# EAGLE design xmas_v3 (EAGLE 7.6.0)
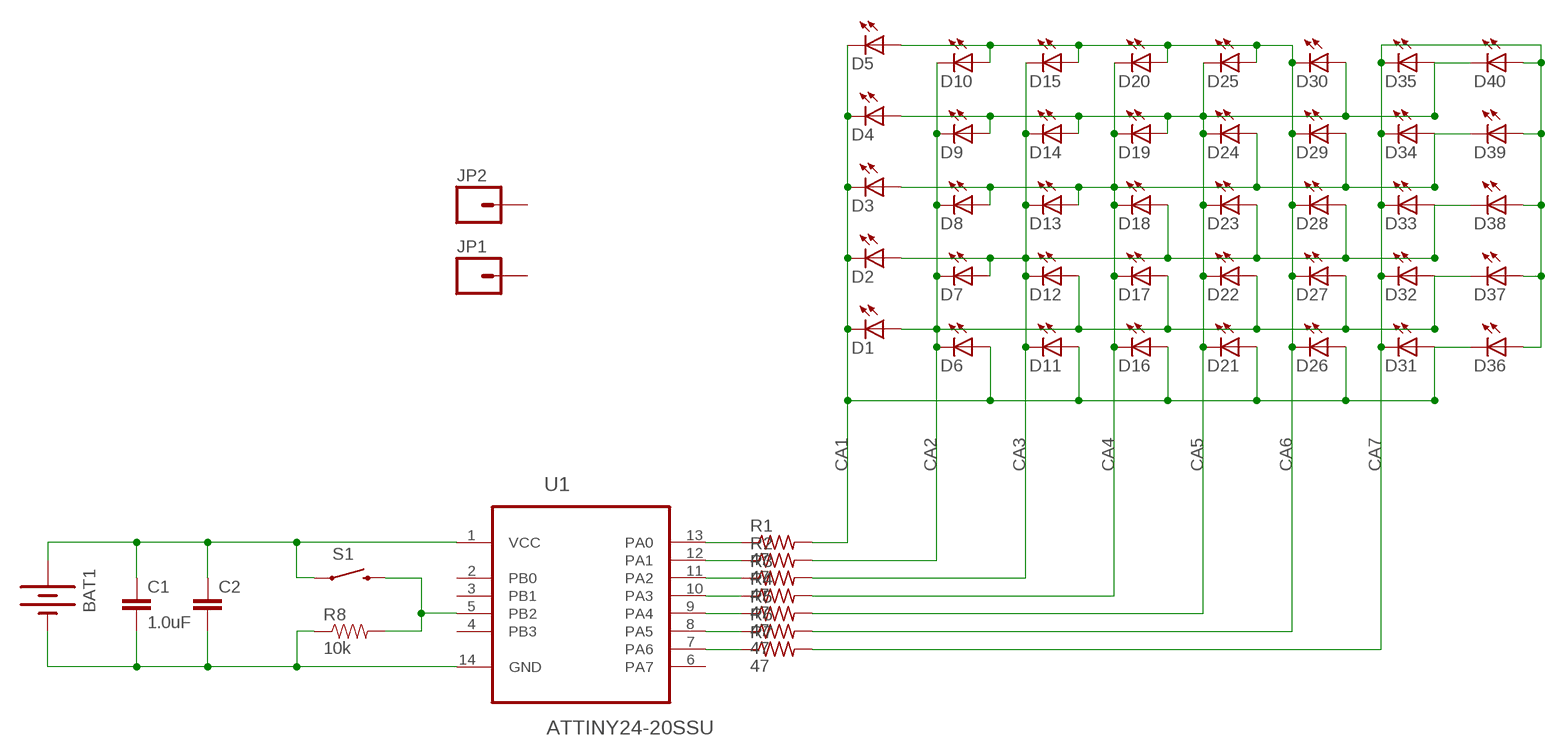
[diagram p0: schematic, sheet 1]

## Parts
BAT1  BATTERY20PTH  [BATTCOM_20MM_PTH]
C1  1.0uF  1.0UF-25V-+80/-20(0805)"  [0805-CAP]
C2  CAP0805  [0805]
D1  LEDCHIP-LED0603  [CHIP-LED0603]
D2  LEDCHIP-LED0603  [CHIP-LED0603]
D3  LEDCHIP-LED0603  [CHIP-LED0603]
D4  LEDCHIP-LED0603  [CHIP-LED0603]
D5  LEDCHIP-LED0603  [CHIP-LED0603]
D6  LEDCHIP-LED0603  [CHIP-LED0603]
D7  LEDCHIP-LED0603  [CHIP-LED0603]
D8  LEDCHIP-LED0603  [CHIP-LED0603]
D9  LEDCHIP-LED0603  [CHIP-LED0603]
D10  LEDCHIP-LED0603  [CHIP-LED0603]
D11  LEDCHIP-LED0603  [CHIP-LED0603]
D12  LEDCHIP-LED0603  [CHIP-LED0603]
D13  LEDCHIP-LED0603  [CHIP-LED0603]
D14  LEDCHIP-LED0603  [CHIP-LED0603]
D15  LEDCHIP-LED0603  [CHIP-LED0603]
D16  LEDCHIP-LED0603  [CHIP-LED0603]
D17  LEDCHIP-LED0603  [CHIP-LED0603]
D18  LEDCHIP-LED0603  [CHIP-LED0603]
D19  LEDCHIP-LED0603  [CHIP-LED0603]
D20  LEDCHIP-LED0603  [CHIP-LED0603]
D21  LEDCHIP-LED0603  [CHIP-LED0603]
D22  LEDCHIP-LED0603  [CHIP-LED0603]
D23  LEDCHIP-LED0603  [CHIP-LED0603]
D24  LEDCHIP-LED0603  [CHIP-LED0603]
D25  LEDCHIP-LED0603  [CHIP-LED0603]
D26  LEDCHIP-LED0603  [CHIP-LED0603]
D27  LEDCHIP-LED0603  [CHIP-LED0603]
D28  LEDCHIP-LED0603  [CHIP-LED0603]
D29  LEDCHIP-LED0603  [CHIP-LED0603]
D30  LEDCHIP-LED0603  [CHIP-LED0603]
D31  LEDCHIP-LED0603  [CHIP-LED0603]
D32  LEDCHIP-LED0603  [CHIP-LED0603]
D33  LEDCHIP-LED0603  [CHIP-LED0603]
D34  LEDCHIP-LED0603  [CHIP-LED0603]
D35  LEDCHIP-LED0603  [CHIP-LED0603]
D36  LEDCHIP-LED0603  [CHIP-LED0603]
D37  LEDCHIP-LED0603  [CHIP-LED0603]
D38  LEDCHIP-LED0603  [CHIP-LED0603]
D39  LEDCHIP-LED0603  [CHIP-LED0603]
D40  LEDCHIP-LED0603  [CHIP-LED0603]
JP1  M01PTH_NO_SILK_YES_STOP  [1X01_NO_SILK]
JP2  M01PTH_NO_SILK_YES_STOP  [1X01_NO_SILK]
R1  47  R-US_R0603  [R0603]
R2  47  R-US_R0603  [R0603]
R3  47  R-US_R0603  [R0603]
R4  47  R-US_R0603  [R0603]
R5  47  R-US_R0603  [R0603]
R6  47  R-US_R0603  [R0603]
R7  47  R-US_R0603  [R0603]
R8  10k  RESISTOR0805-RES  [0805]
S1  SWITCH-MOMENTARY-2SMD-4  [TACTILE_SWITCH_TALL]
U1  ATTINY24-20SSU  [SOIC127P600X175-14N]

## Nets
CA1: D1.C D2.C D3.C D4.C D5.C D6.A D11.A D16.A D21.A D26.A D31.A D36.C R1.2
CA2: D1.A D6.C D7.C D8.C D9.C D10.C D12.A D17.A D22.A D27.A D32.A D37.C R2.2
CA3: D2.A D7.A D11.C D12.C D13.C D14.C D15.C D18.A D23.A D28.A D33.A D38.C R3.2
CA4: D3.A D8.A D13.A D16.C D17.C D18.C D19.C D20.C D24.A D29.A D34.A D39.C R4.2
CA5: D4.A D9.A D14.A D19.A D21.C D22.C D23.C D24.C D25.C D30.A D35.A D40.C R5.2
CA6: D5.A D10.A D15.A D20.A D25.A D26.C D27.C D28.C D29.C D30.C R6.2
CA7: D31.C D32.C D33.C D34.C D35.C D36.A D37.A D38.A D39.A D40.A R7.2
GND: BAT1.2(-) C1.2 C2.2 R8.1 U1.14(GND)
N$1: BAT1.1(+) C1.1 C2.1 S1.A2 U1.1(VCC)
N$2: R8.2 S1.B2 U1.5(PB2)
N$3: R1.1 U1.13(PA0)
N$4: R2.1 U1.12(PA1)
N$5: R3.1 U1.11(PA2)
N$6: R4.1 U1.10(PA3)
N$7: R5.1 U1.9(PA4)
N$8: R6.1 U1.8(PA5)
N$9: R7.1 U1.7(PA6)
Unconnected: JP1.1 JP2.1 U1.2(PB0) U1.3(PB1) U1.4(PB3) U1.6(PA7)

## Library data of the parts
BAT1 = SparkFun-Electromechanical:BATTERY: Battery Holders Various common sizes : AA, AAA, 18650 (PRT-12895), 20mm coin cell and 12mm coin cell. 20MM_4LEGS, BATT-10373
C1 = SparkFun-Capacitors:1.0UF-25V-+80/-20(0805): CAP-11625; PROD_ID: CAP-11625
C2 = SparkFun-Capacitors:CAP: Capacitor Standard 0603 ceramic capacitor, and 0.1" leaded capacitor.
D1-D40 = adafruit:LED: LED OSRAM: - CHIPLED LG R971, LG N971, LY N971, LG Q971, LY Q971, LO R971, LY R971 LH N974, LH R974 LS Q976, LO Q976, LY Q976 LO Q996 - Hyper CHIPLED LW Q18S LB Q993, LB Q99A, LB R99A - SideLED LS A670, LO A670, LY A670, LG A670, LP A670 LB A673, LV A673, LT A673, LW A673 LH A674 LY A675 LS A676, LA A676, LO A676, LY A676, LW A676 LS A679, LY A679, LG A679 - Hyper Micro SIDELED® LS Y876, LA Y876, LO Y876, LY Y876 LT Y87S - SmartLED LW L88C, LW L88S LB L89C, LB L89S, LG L890 LS L89K, LO L89K, LY L89K LS L896, LA L896, LO L896, LY L896 - TOPLED LS T670, LO T670, LY T670, LG T670, LP T670 LSG T670, LSP T670, LSY T670, LOP T670, LYG T670 LG T671, LOG T671, LSG T671 LB T673, LV T673, LT T673, LW T673 LH T674 LS T676, LA T676, LO T676, LY T676, LB T676, LH T676, LSB T676, LW T676 LB T67C, LV T67C, LT T67C, LS T67K, LO T67K, LY T67K, LW E67C LS E67B, LA E67B, LO E67B, LY E67B, LB E67C, LV E67C, LT E67C LW T67C LS T679, LY T679, LG T679 LS T770, LO T770, LY T770, LG T770, LP T770 LB T773, LV T773, LT T773, LW T773 LH T774 LS E675, LA E675, LY E675, LS T675 LS T776, LA T776, LO T776, LY T776, LB T776 LHGB T686 LT T68C, LB T68C - Hyper Mini TOPLED® LB M676 - Mini TOPLED Santana® LG M470 LS M47K, LO M47K, LY M47K Source: http://www.osram.convergy.de/
JP1 JP2 = SparkFun-Connectors:M01: Header 1 Standard 1-pin 0.1" header. Use with straight break away headers (SKU : PRT-00116), right angle break away headers (PRT-00553), swiss pins (PRT-00743), machine pins (PRT-00117), and female headers (PRT-00115). SMTSO-256-ET is a "flush mount" nut for a 4-40 screw. The older package used to be too tight, and did not allow it to sit properly thru the drill hit. The latest (0.165DIA) fits nice and snug.
R1-R7 = resistor:R-US_: RESISTOR, American symbol
R8 = SparkFun-Passives:RESISTOR: Resistor Basic schematic elements and footprints for 0603, 1206, and PTH resistors.
S1 = SparkFun-Electromechanical:SWITCH-MOMENTARY-2: Various NO switches- pushbuttons, reed, etc; PROD_ID: SWCH-11966
U1 = Atmel_By_element14_Batch_1-00:ATTINY24-20SSU: 8-bit Microcontroller with Bytes In-System Programmable Flash; MPN: ATTINY24-20SSU; OC_FARNELL: 1455137; OC_NEWARK: 58M3775; PACKAGE: SOIC-14; SUPPLIER: Atmel

## Board
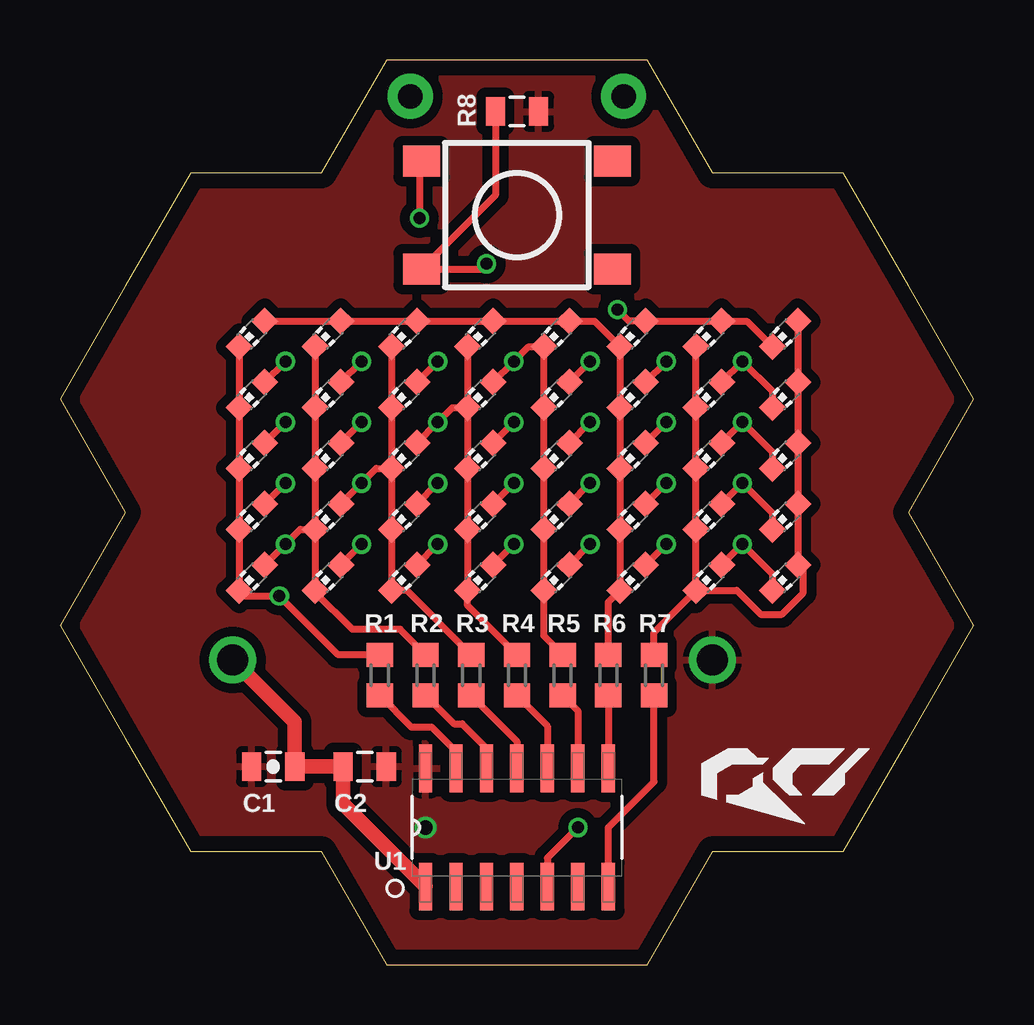
[diagram p1: board, top side]
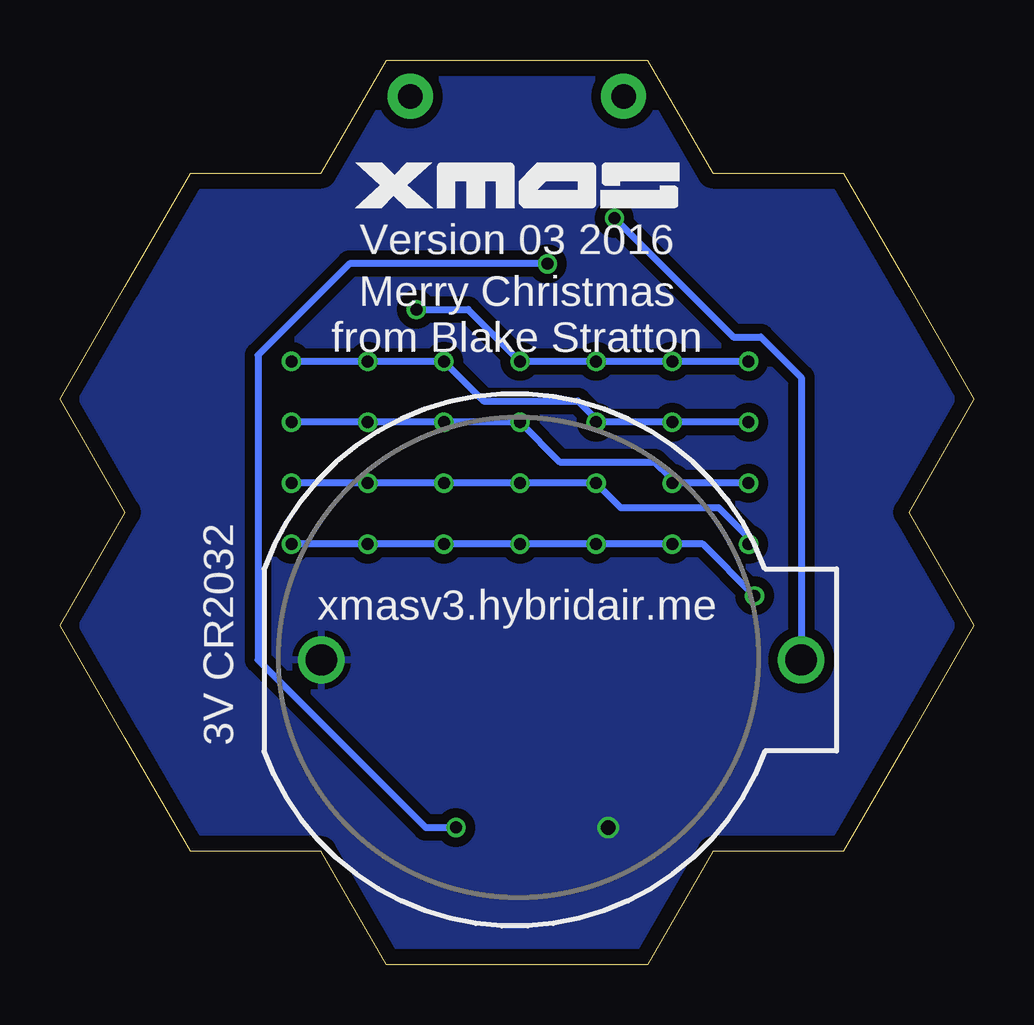
[diagram p2: board, bottom side, seen from below]

Size 38.1 x 37.71 mm. Coordinates in mm from the lower left corner, seen from the top.
Outline: 27.21,4.71 32.66,4.71 35.38,9.43 38.1,14.14 35.38,18.86 38.1,23.57 35.38,28.28 32.66,33 27.21,33 24.49,37.71 13.61,37.71 10.89,33 5.44,33 2.72,28.28 0,23.57 2.72,18.86 0,14.14 2.72,9.43 5.44,4.71 10.89,4.71 13.61,0 24.49,0 27.21,4.71
Copper layers (1*16): Top 0.035mm / dielectric 1.5mm / Bottom 0.035mm
Design rules "SeeedStudio_2layer_DRU_no_angle_20140221": minimum track width 6mil, minimum drill 12mil, track to track 6mil, track to pad 6mil, pad to pad 6mil, via to via 6mil, smd to smd 0mil, copper to edge 10mil, drill to drill 10mil, minimum pad ring 10mil, minimum via ring 6mil, stop-mask expansion 2mil, vias tented up to drill 100mil, thermal gap 10mil
tRestrict: 22 lines
bRestrict: 22 lines

### Footprints (pad centres in the part's own frame; a part is rotated, then mirrored left to right if it is on the bottom)
BATTCOM_20MM_PTH = drill 1.3: 1 11.85,0; 2 -8.15,0
0805-CAP = smd 0.8 x 1.2: 1 -0.9,0; 2 0.9,0
0805 = smd 0.8 x 1.2: 1 -0.9,0; 2 0.9,0
CHIP-LED0603 = smd 0.8 x 0.8: A 0,-0.75; C 0,0.75
1X01_NO_SILK = drill 1.016 pad 1.88: 1 0,0
R0603 = smd 1 x 1.1: 1 -0.85,0; 2 0.85,0
TACTILE_SWITCH_TALL = smd 1.55 x 1.3: A1 -3.975,-2.25; A2 3.975,-2.25; B1 -3.975,2.25; B2 3.975,2.25
SOIC127P600X175-14N = smd 1.981 x 0.559: 1 -2.464,3.81; 2 -2.464,2.54; 3 -2.464,1.27; 4 -2.464,0; 5 -2.464,-1.27; 6 -2.464,-2.54; 7 -2.464,-3.81; 8 2.464,-3.81; 9 2.464,-2.54; 10 2.464,-1.27; 11 2.464,0; 12 2.464,1.27; 13 2.464,2.54; 14 2.464,3.81

### Placement (x,y rotation side)
BAT1  19.05,12.7 0 bottom
C1  8.89,8.26 180 top
C2  12.7,8.26 0 top
D1  8,16.13 135 top
D2  8,18.67 135 top
D3  8,21.21 135 top
D4  8,23.75 135 top
D5  8,26.29 135 top
D6  11.18,16.13 135 top
D7  11.18,18.67 135 top
D8  11.18,21.21 135 top
D9  11.18,23.75 135 top
D10  11.18,26.29 135 top
D11  14.35,16.13 135 top
D12  14.35,18.67 135 top
D13  14.35,21.21 135 top
D14  14.35,23.75 135 top
D15  14.35,26.29 135 top
D16  17.53,16.13 135 top
D17  17.53,18.67 135 top
D18  17.53,21.21 135 top
D19  17.53,23.75 135 top
D20  17.53,26.29 135 top
D21  20.7,16.13 135 top
D22  20.7,18.67 135 top
D23  20.7,21.21 135 top
D24  20.7,23.75 135 top
D25  20.7,26.29 135 top
D26  23.88,16.13 135 top
D27  23.88,18.67 135 top
D28  23.88,21.21 135 top
D29  23.88,23.75 135 top
D30  23.88,26.29 135 top
D31  27.05,16.13 135 top
D32  27.05,18.67 135 top
D33  27.05,21.21 135 top
D34  27.05,23.75 135 top
D35  27.05,26.29 135 top
D36  30.23,16.13 135 top
D37  30.23,18.67 135 top
D38  30.23,21.21 135 top
D39  30.23,23.75 135 top
D40  30.23,26.29 135 top
JP1  14.61,36.2 0 top
JP2  23.5,36.2 0 top
R1  13.34,12.06 90 top
R2  15.24,12.06 90 top
R3  17.14,12.06 90 top
R4  19.05,12.06 90 top
R5  20.95,12.06 90 top
R6  22.86,12.06 90 top
R7  24.77,12.06 90 top
R8  19.05,35.56 180 top
S1  19.05,31.24 180 top
U1  19.05,5.71 90 top
U$1  [AR1]  26.67,5.84 0 top
U$2  [XMAS]  25.83,31.37 0 bottom

### Tracks (layer width: path | path; a pad name or v marks a point on that pad's centre or on a via)
CA1  (via drill 0.5)
  Top 0.3: D5.C D4.C D3.C D2.C D1.C 7.7,15.37 v9.14,15.37 11.6,12.91 R1.2 | D6.A v12.57,17.53 | D11.A v15.75,17.53 | D16.A v18.92,17.53 | D21.A v22.1,17.53 | D26.A v25.27,17.53 | D31.A v28.45,17.53 29.7,16.28 D36.C
  Bottom 0.3: v9.14,15.37 11.3,17.53 v12.57,17.53 v15.75,17.53 v18.92,17.53 v22.1,17.53 v25.27,17.53 v28.45,17.53
CA2  (via drill 0.5)
  Top 0.3: D10.C D9.C D8.C D7.C | D7.C D6.C 10.65,15.52 12.19,13.97 14.19,13.97 R2.2 | D1.A v9.4,17.53 10.01,18.14 D7.C | D12.A v15.75,20.07 | D17.A v18.92,20.07 | D22.A v22.1,20.07 | D27.A v25.27,20.07 | D32.A v28.45,20.07 29.7,18.82 D37.C
  Bottom 0.3: v9.4,17.53 9.4,17.8 10.65,19.05 14.73,19.05 v15.75,20.07 v18.92,20.07 v22.1,20.07 v25.27,20.07 v28.45,20.07
CA3  (via drill 0.5)
  Top 0.3: D15.C D14.C D13.C | D13.C D12.C D11.C 14.46,15.6 R3.2 | D2.A v9.4,20.07 | D7.A v12.57,20.07 13.19,20.68 D13.C | D18.A v18.92,22.61 | D23.A v22.1,22.61 | D28.A v25.27,22.61 | D33.A v28.45,22.61 29.7,21.36 D38.C
  Bottom 0.3: v9.4,20.07 v12.57,20.07 12.7,20.34 13.31,20.95 17.27,20.95 v18.92,22.61 v22.1,22.61 v25.27,22.61 v28.45,22.61
CA4  (via drill 0.5)
  Top 0.3: D20.C D19.C | D19.C D18.C D17.C D16.C 17,14.97 R4.2 | D3.A v9.4,22.61 | D8.A v12.57,22.61 | D13.A v15.75,22.61 16.36,23.22 D19.C | D24.A v22.1,25.15 | D29.A v25.27,25.15 | D34.A v28.45,25.15 29.7,23.9 D39.C
  Bottom 0.3: v9.4,22.61 v12.57,22.61 v15.75,22.61 15.75,22.73 16.51,23.5 20.45,23.5 v22.1,25.15 v25.27,25.15 v28.45,25.15
CA5  (via drill 0.5)
  Top 0.3: D4.A v9.4,25.15 | D9.A v12.57,25.15 | D14.A v15.75,25.15 | D19.A v18.92,25.15 19.54,25.76 D25.C D24.C D23.C D22.C D21.C 20.17,13.7 R5.2 | D40.C 28.64,26.82 D35.A D30.A 23.73,26.82 v23.24,27.3
  Bottom 0.3: v9.4,25.15 v12.57,25.15 v15.75,25.15 v18.92,25.15 21.08,27.3 v23.24,27.3
CA6
  Top 0.3: D5.A D10.A D15.A D20.A D25.A 22.29,26.82 D30.C D29.C D28.C D27.C D26.C 22.86,15.11 R6.2
CA7
  Top 0.3: D35.C D34.C D33.C D32.C D31.C | D40.A D39.A D38.A D37.A D36.A 30.99,16.43 30.99,15.49 30.1,14.61 29.21,14.61 28.22,15.6 D31.C | R7.2 24.77,13.84 D31.C
GND  (via drill 0.6)
  other vias: 15.24,5.71
  pour Top (isolate 0.4): 27.21,4.71 32.66,4.71 35.38,9.43 38.1,14.14 35.38,18.85 38.1,23.57 35.38,28.28 32.66,33 27.21,33 24.49,37.71 13.61,37.71 10.89,33 5.44,33 2.72,28.28 0,23.57 2.72,18.85 0,14.14 2.72,9.43 5.44,4.71 10.89,4.71 13.61,0 24.49,0
  pour Bottom (isolate 0.4): 27.21,4.71 32.66,4.71 35.38,9.43 38.1,14.14 35.38,18.85 38.1,23.57 35.38,28.28 32.66,33 27.21,33 24.49,37.71 13.61,37.71 10.89,33 5.44,33 2.72,28.28 0,23.57 2.72,18.85 0,14.14 2.72,9.43 5.44,4.71 10.89,4.71 13.61,0 24.49,0
N$1  (via drill 0.5)
  Top 0.3: S1.A2 14.99,33.4 v14.99,31.11
  Top 0.6: BAT1.1 9.79,10.11 C1.1 C2.1 11.8,6.69 U1.1
  Bottom 0.3: v14.99,31.11 10.03,26.16 8.89,26.16 7.2,24.47 BAT1.1
N$2  (via drill 0.5)
  Top 0.3: R8.2 18.15,32.07 S1.B2 17.56,28.99 v17.78,29.21 | v21.59,5.71 20.32,4.45 U1.5
  Bottom 0.3: v17.78,29.21 26.04,29.21 29.84,25.4 29.84,12.7 22.86,5.71 v21.59,5.71
N$3
  Top 0.3: R1.1 14.64,9.91 15.49,9.91 16.51,8.89 U1.13
N$4
  Top 0.3: R2.1 16.42,10.03 16.76,10.03 17.78,9.02 U1.12
N$5
  Top 0.3: R3.1 19.05,9.31 U1.11
N$6
  Top 0.3: R4.1 20.32,9.95 U1.10
N$7
  Top 0.3: R5.1 21.59,10.58 U1.9
N$8
  Top 0.3: R6.1 U1.8
N$9
  Top 0.3: U1.7 22.86,5.71 24.77,7.62 R7.1

### Text on the board
bPlace: Version 03 2016 | Merry Christmas / from Blake Stratton | xmasv3.hybridair.me | 3V CR2032